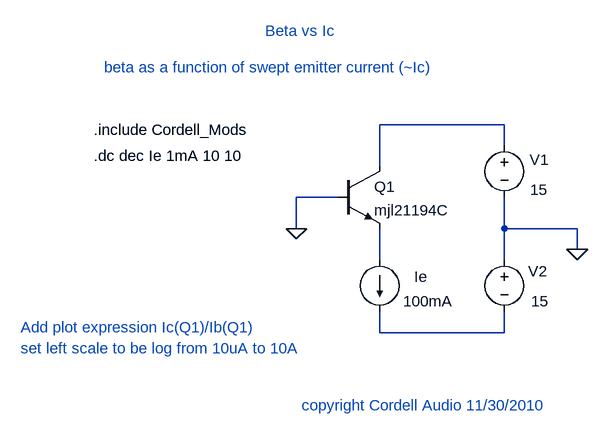
[diagram p0: schematic Beta vs Ic.asc]
Beta vs Ic.asc, the LTspice schematic file:
Version 4
SHEET 1 880 680
WIRE 192 192 0 192
WIRE 192 224 192 192
WIRE 0 256 0 192
WIRE -64 304 -128 304
WIRE -128 352 -128 304
WIRE 192 352 192 304
WIRE 304 352 192 352
WIRE 304 384 304 352
WIRE 0 400 0 352
WIRE 192 400 192 352
WIRE 0 512 0 480
WIRE 192 512 192 480
WIRE 192 512 0 512
FLAG 304 384 0
FLAG -128 352 0
SYMBOL voltage 192 208 R0
WINDOW 123 0 0 Left 0
WINDOW 39 0 0 Left 0
WINDOW 0 39 38 Left 0
WINDOW 3 40 84 Left 0
SYMATTR InstName V1
SYMATTR Value 15
SYMBOL npn -64 256 R0
SYMATTR InstName Q1
SYMATTR Value mjl21194C
SYMBOL current 0 400 R0
WINDOW 123 0 0 Left 0
WINDOW 39 0 0 Left 0
WINDOW 0 53 26 Left 0
WINDOW 3 36 64 Left 0
SYMATTR InstName Ie
SYMATTR Value 100mA
SYMBOL voltage 192 384 R0
WINDOW 123 0 0 Left 0
WINDOW 39 0 0 Left 0
WINDOW 0 37 34 Left 0
WINDOW 3 41 80 Left 0
SYMATTR InstName V2
SYMATTR Value 15
TEXT -176 48 Left 0 ;Beta vs Ic
TEXT -440 240 Left 0 !.dc dec Ie 1mA 10 10
TEXT -552 536 Left 0 ;set left scale to be log from 10uA to 10A
TEXT -552 504 Left 0 ;Add plot expression Ic(Q1)/Ib(Q1)
TEXT -120 624 Left 0 ;copyright Cordell Audio 11/30/2010
TEXT -440 200 Left 0 !.include Cordell_Mods
TEXT -424 104 Left 0 ;beta as a function of swept emitter current (~Ic)

The netlist it stands for:
* Beta vs Ic.asc
V1 N001 0 15
Q1 N001 0 N002 0 mjl21194C
Ie N002 N003 100mA
V2 0 N003 15
.model NPN NPN
.model PNP PNP
.lib standard.bjt
* Beta vs Ic
.dc dec Ie 1mA 10 10
* set left scale to be log from 10uA to 10A
* Add plot expression Ic(Q1)/Ib(Q1)
* copyright Cordell Audio 11/30/2010
.include Cordell_Mods
* beta as a function of swept emitter current (~Ic)
.backanno
.end